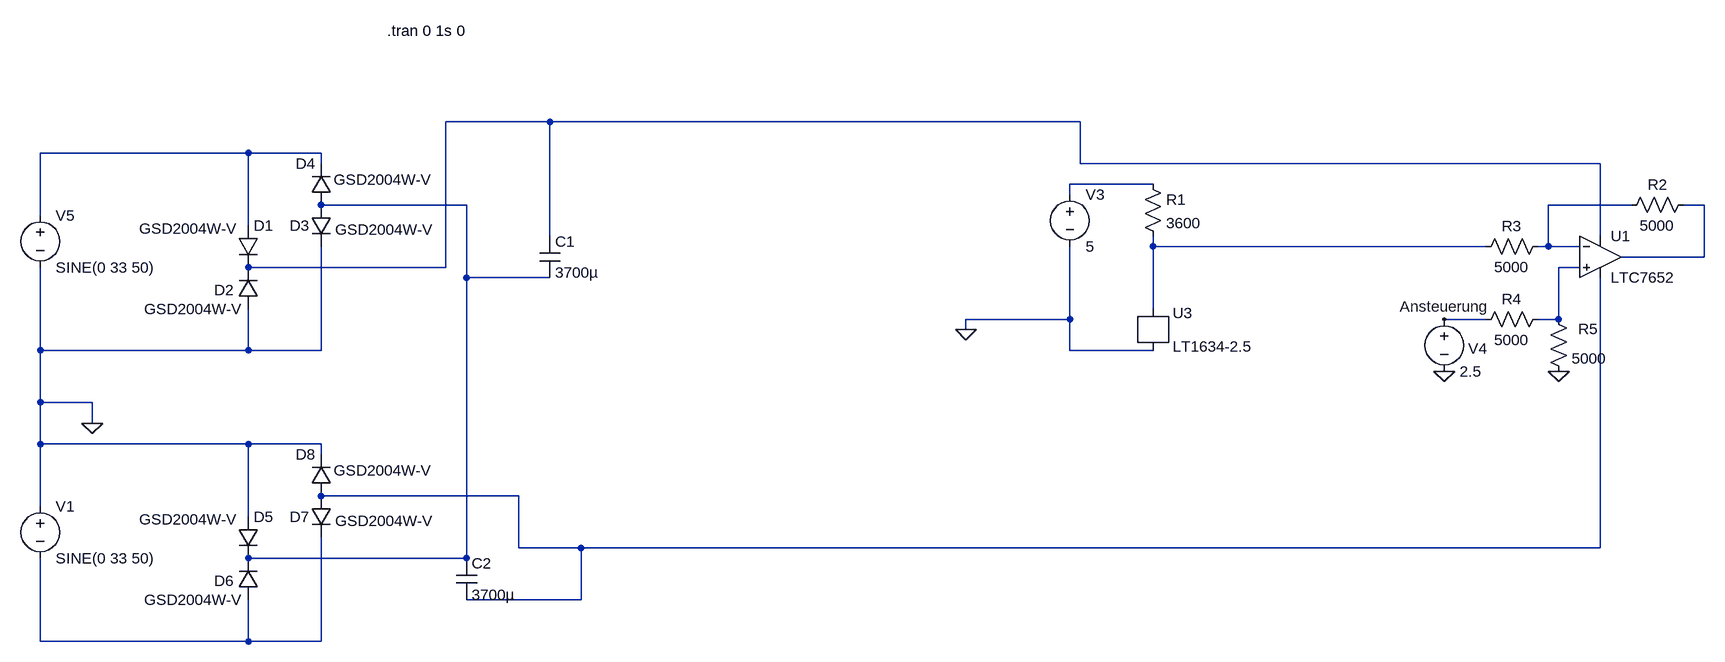
[diagram p0: schematic Subtractor.asc]
Subtractor.asc, the LTspice schematic file:
Version 4
SHEET 1 1604 792
WIRE -176 -16 -336 -16
WIRE 640 -16 -176 -16
WIRE -640 32 -960 32
WIRE -528 32 -640 32
WIRE -528 48 -528 32
WIRE 640 48 640 -16
WIRE 1440 48 640 48
WIRE 752 80 624 80
WIRE 624 96 624 80
WIRE -304 112 -528 112
WIRE 1488 112 1360 112
WIRE 1600 112 1568 112
WIRE -960 128 -960 32
WIRE -640 144 -640 32
WIRE -176 160 -176 -16
WIRE 1440 160 1440 48
WIRE 752 176 752 160
WIRE 1264 176 752 176
WIRE 1360 176 1360 112
WIRE 1360 176 1344 176
WIRE 1408 176 1360 176
WIRE 1600 192 1600 112
WIRE 1600 192 1472 192
WIRE -336 208 -336 -16
WIRE -336 208 -640 208
WIRE 1408 208 1376 208
WIRE -304 224 -304 112
WIRE -176 224 -304 224
WIRE 752 272 752 176
WIRE 624 288 624 176
WIRE 624 288 464 288
WIRE 1264 288 1200 288
WIRE 1376 288 1376 208
WIRE 1376 288 1344 288
WIRE 464 304 464 288
WIRE -960 336 -960 208
WIRE -640 336 -640 272
WIRE -640 336 -960 336
WIRE -528 336 -528 176
WIRE -528 336 -640 336
WIRE 624 336 624 288
WIRE 752 336 624 336
WIRE -960 416 -960 336
WIRE -880 416 -960 416
WIRE -880 448 -880 416
WIRE -960 480 -960 416
WIRE -640 480 -960 480
WIRE -528 480 -640 480
WIRE -528 496 -528 480
WIRE -224 560 -528 560
WIRE -960 576 -960 480
WIRE -640 592 -640 480
WIRE -224 640 -224 560
WIRE -128 640 -224 640
WIRE 1440 640 1440 224
WIRE 1440 640 -128 640
WIRE -304 656 -304 224
WIRE -304 656 -640 656
WIRE -128 720 -128 640
WIRE -128 720 -304 720
WIRE -960 784 -960 656
WIRE -640 784 -640 720
WIRE -640 784 -960 784
WIRE -528 784 -528 624
WIRE -528 784 -640 784
FLAG 464 304 0
FLAG 1376 368 0
FLAG 1200 368 0
FLAG 1200 288 Ansteuerung
FLAG -880 448 0
SYMBOL voltage 624 80 R0
WINDOW 123 0 0 Left 2
WINDOW 39 0 0 Left 2
SYMATTR InstName V3
SYMATTR Value 5
SYMBOL res 736 64 R0
SYMATTR InstName R1
SYMATTR Value 3600
SYMBOL Opamps\\LTC7652 1440 128 R0
SYMATTR InstName U1
SYMBOL res 1472 128 R270
WINDOW 0 32 56 VTop 2
WINDOW 3 0 56 VBottom 2
SYMATTR InstName R2
SYMATTR Value 5000
SYMBOL res 1248 192 R270
WINDOW 0 32 56 VTop 2
WINDOW 3 0 56 VBottom 2
SYMATTR InstName R3
SYMATTR Value 5000
SYMBOL res 1248 304 R270
WINDOW 0 32 56 VTop 2
WINDOW 3 0 56 VBottom 2
SYMATTR InstName R4
SYMATTR Value 5000
SYMBOL res 1360 272 R0
WINDOW 0 46 31 Left 2
SYMATTR InstName R5
SYMATTR Value 5000
SYMBOL voltage 1200 272 R0
WINDOW 0 37 61 Left 2
WINDOW 123 0 0 Left 2
WINDOW 39 0 0 Left 2
SYMATTR InstName V4
SYMATTR Value 2.5
SYMBOL References\\LT1634-2.5 752 304 R0
SYMATTR InstName U3
SYMBOL diode -656 144 R0
WINDOW 3 -152 4 Left 2
SYMATTR InstName D1
SYMATTR Value GSD2004W-V
SYMBOL voltage -960 112 R0
WINDOW 123 0 0 Left 2
WINDOW 39 0 0 Left 2
SYMATTR InstName V5
SYMATTR Value SINE(0 33 50)
SYMBOL diode -624 272 R180
WINDOW 0 38 29 Left 2
WINDOW 3 24 0 Left 2
SYMATTR InstName D2
SYMATTR Value GSD2004W-V
SYMBOL diode -544 112 R0
WINDOW 0 -32 32 Left 2
WINDOW 3 38 38 Left 2
SYMATTR InstName D3
SYMATTR Value GSD2004W-V
SYMBOL diode -512 112 R180
WINDOW 0 24 64 Left 2
WINDOW 3 -156 39 Left 2
SYMATTR InstName D4
SYMATTR Value GSD2004W-V
SYMBOL cap -192 160 R0
SYMATTR InstName C1
SYMATTR Value 3700µ
SYMBOL diode -656 592 R0
WINDOW 3 -152 4 Left 2
SYMATTR InstName D5
SYMATTR Value GSD2004W-V
SYMBOL voltage -960 560 R0
WINDOW 123 0 0 Left 2
WINDOW 39 0 0 Left 2
SYMATTR InstName V1
SYMATTR Value SINE(0 33 50)
SYMBOL diode -624 720 R180
WINDOW 0 38 29 Left 2
WINDOW 3 24 0 Left 2
SYMATTR InstName D6
SYMATTR Value GSD2004W-V
SYMBOL diode -544 560 R0
WINDOW 0 -32 32 Left 2
WINDOW 3 38 38 Left 2
SYMATTR InstName D7
SYMATTR Value GSD2004W-V
SYMBOL diode -512 560 R180
WINDOW 0 24 64 Left 2
WINDOW 3 -156 39 Left 2
SYMATTR InstName D8
SYMATTR Value GSD2004W-V
SYMBOL cap -320 656 R0
SYMATTR InstName C2
SYMATTR Value 3700µ
TEXT -426 -156 Left 2 !.tran 0 1s 0

The netlist it stands for:
* Subtractor.asc
V3 N003 0 5
R1 N003 N007 3600
XU1 N008 N005 N001 N009 N006 LTC1052  ; LTC7652, pins In+ In- V+ V- OUT
R2 N005 N006 5000
R3 N007 N005 5000
R4 Ansteuerung N008 5000
R5 N008 0 5000
V4 Ansteuerung 0 2.5
XU3 N007 0 LT1634-2.5
D1 N002 N001 GSD2004W-V
V5 N002 0 SINE(0 33 50)
D2 0 N001 GSD2004W-V
D3 N004 0 GSD2004W-V
D4 N004 N002 GSD2004W-V
C1 N001 N004 3700µ
D5 0 N004 GSD2004W-V
V1 0 N010 SINE(0 33 50)
D6 N010 N004 GSD2004W-V
D7 N009 N010 GSD2004W-V
D8 N009 0 GSD2004W-V
C2 N004 N009 3700µ
.model D D
.lib standard.dio
.tran 0 1s 0
.backanno
.end